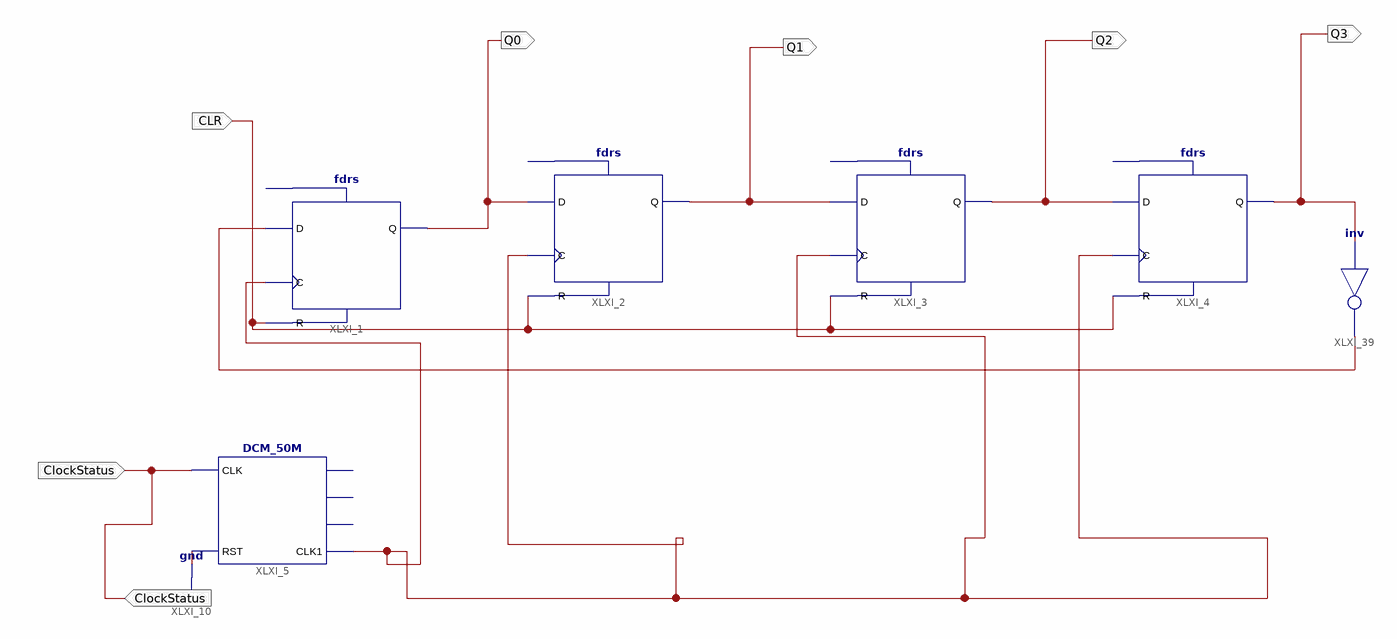
[diagram p0: schematic sheet 1]
// Xilinx ISE schematic lab7_experiment9.sch (spartan3e) as structural Verilog: 6 symbols, 6 ports
module lab7_experiment9 (
  input  ClockStatus,
  input  CLR,
  output Q0,
  output Q1,
  output Q2,
  output Q3
);

  wire XLXN_69, XLXN_80;

  fdrs XLXI_2 (.C(XLXN_69), .D(Q0), .R(CLR), .Q(Q1));  // open: S
  fdrs XLXI_3 (.C(XLXN_69), .D(Q1), .R(CLR), .Q(Q2));  // open: S
  fdrs XLXI_4 (.C(XLXN_69), .D(Q2), .R(CLR), .Q(Q3));  // open: S
  fdrs XLXI_1 (.C(XLXN_69), .D(XLXN_80), .R(CLR), .Q(Q0));  // open: S
  DCM_50M XLXI_5 (.CLK(ClockStatus), .RST(1'b0), .CLK1(XLXN_69));  // open: CLK1M, CLK10k, CLK1k
  not XLXI_39 (XLXN_80, Q3);
endmodule
